# EAGLE schematic ZabavySign (EAGLE 7.2.0), part 1 of 2
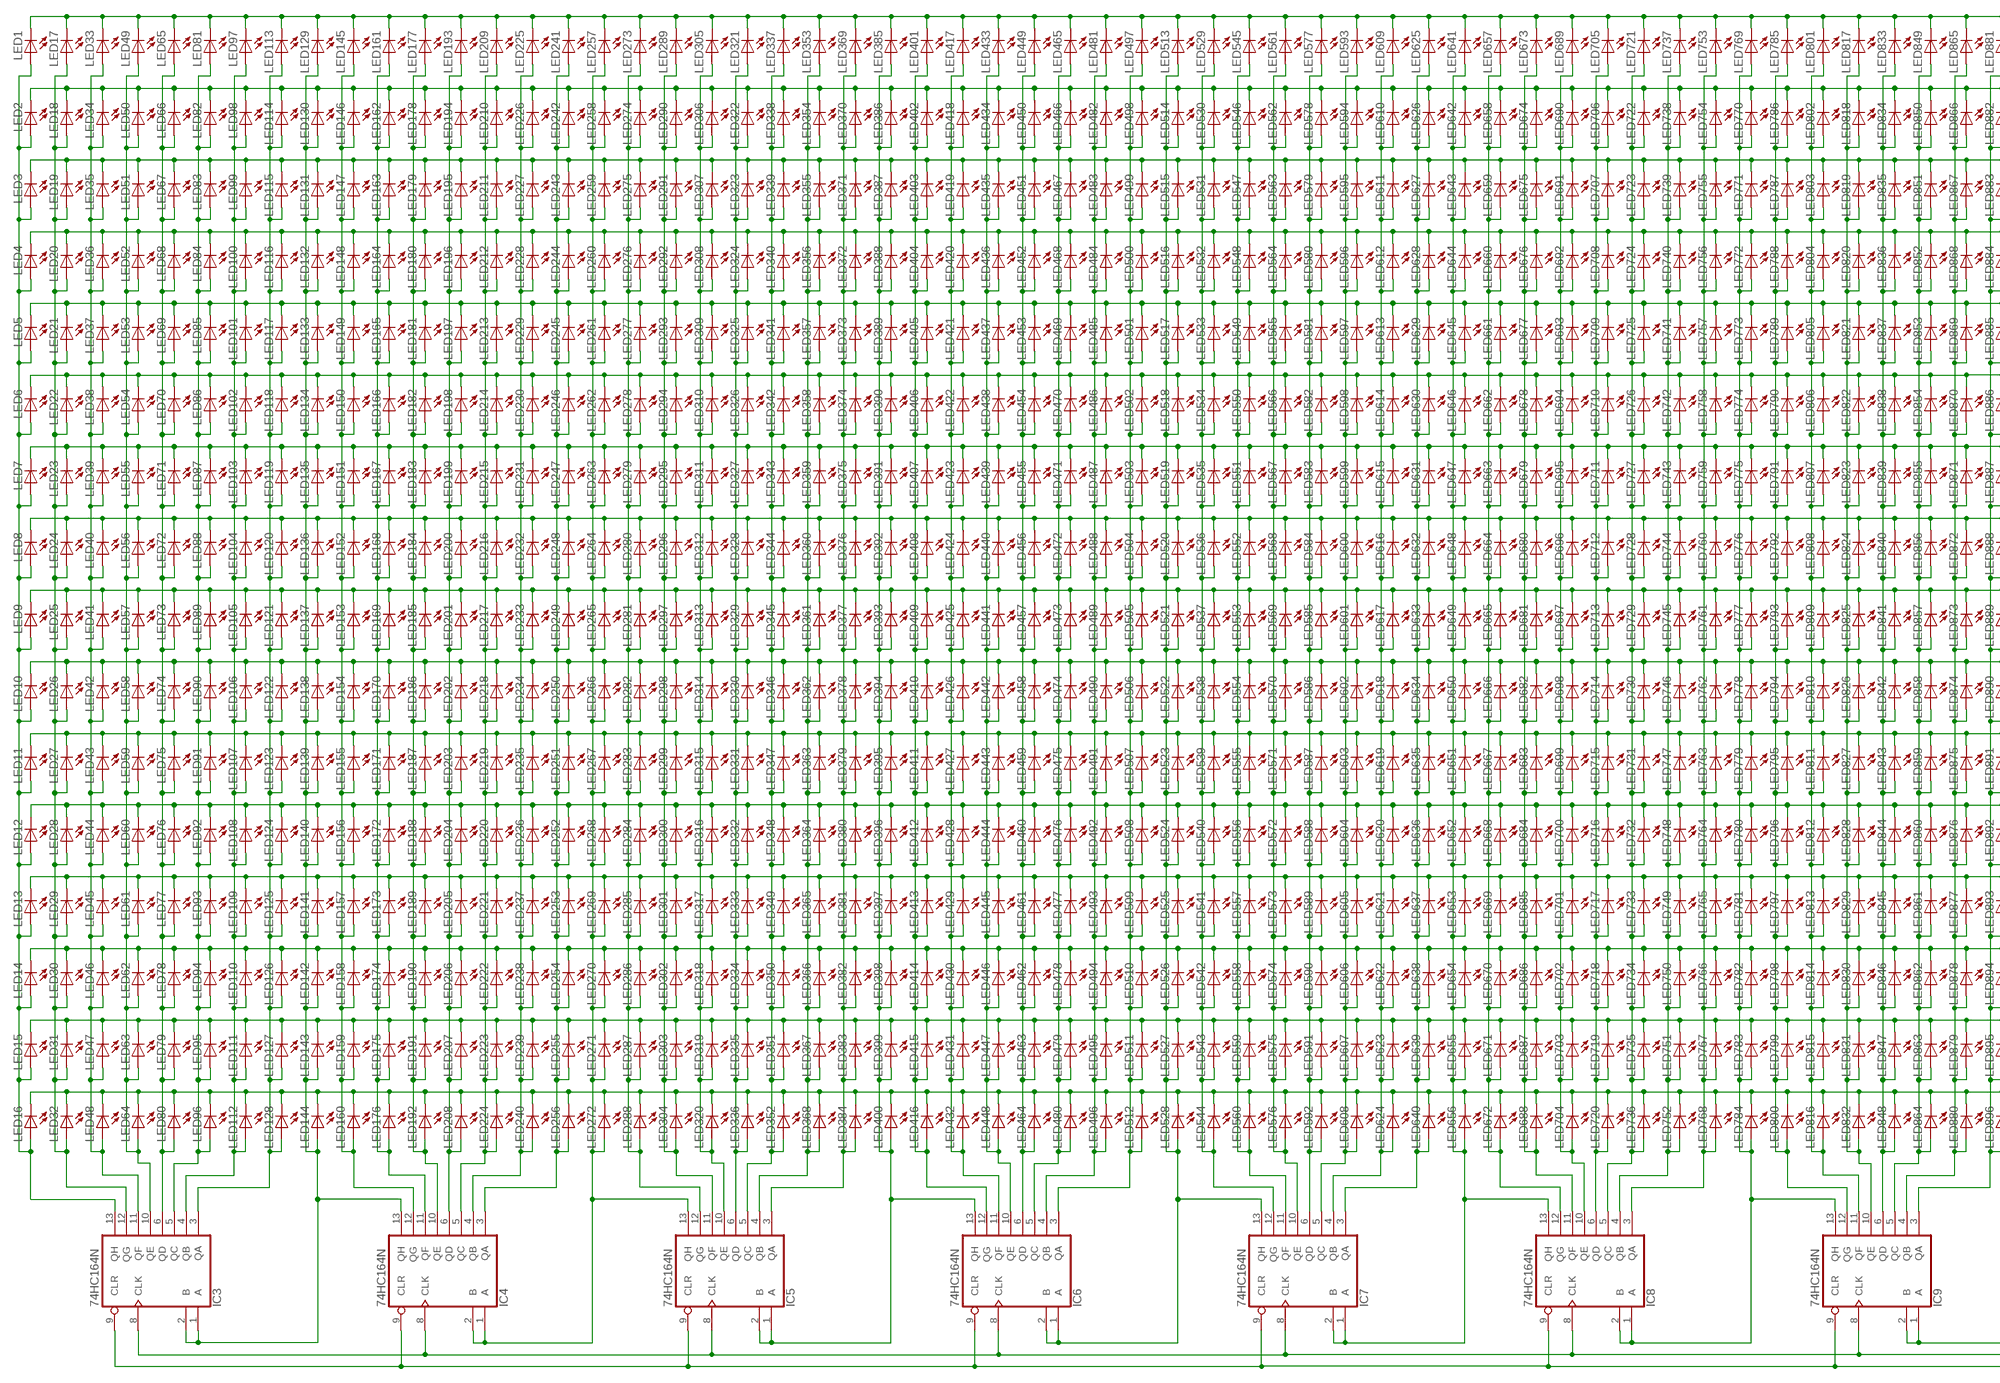
[diagram p0: schematic, sheet 1, part 1 of 2]
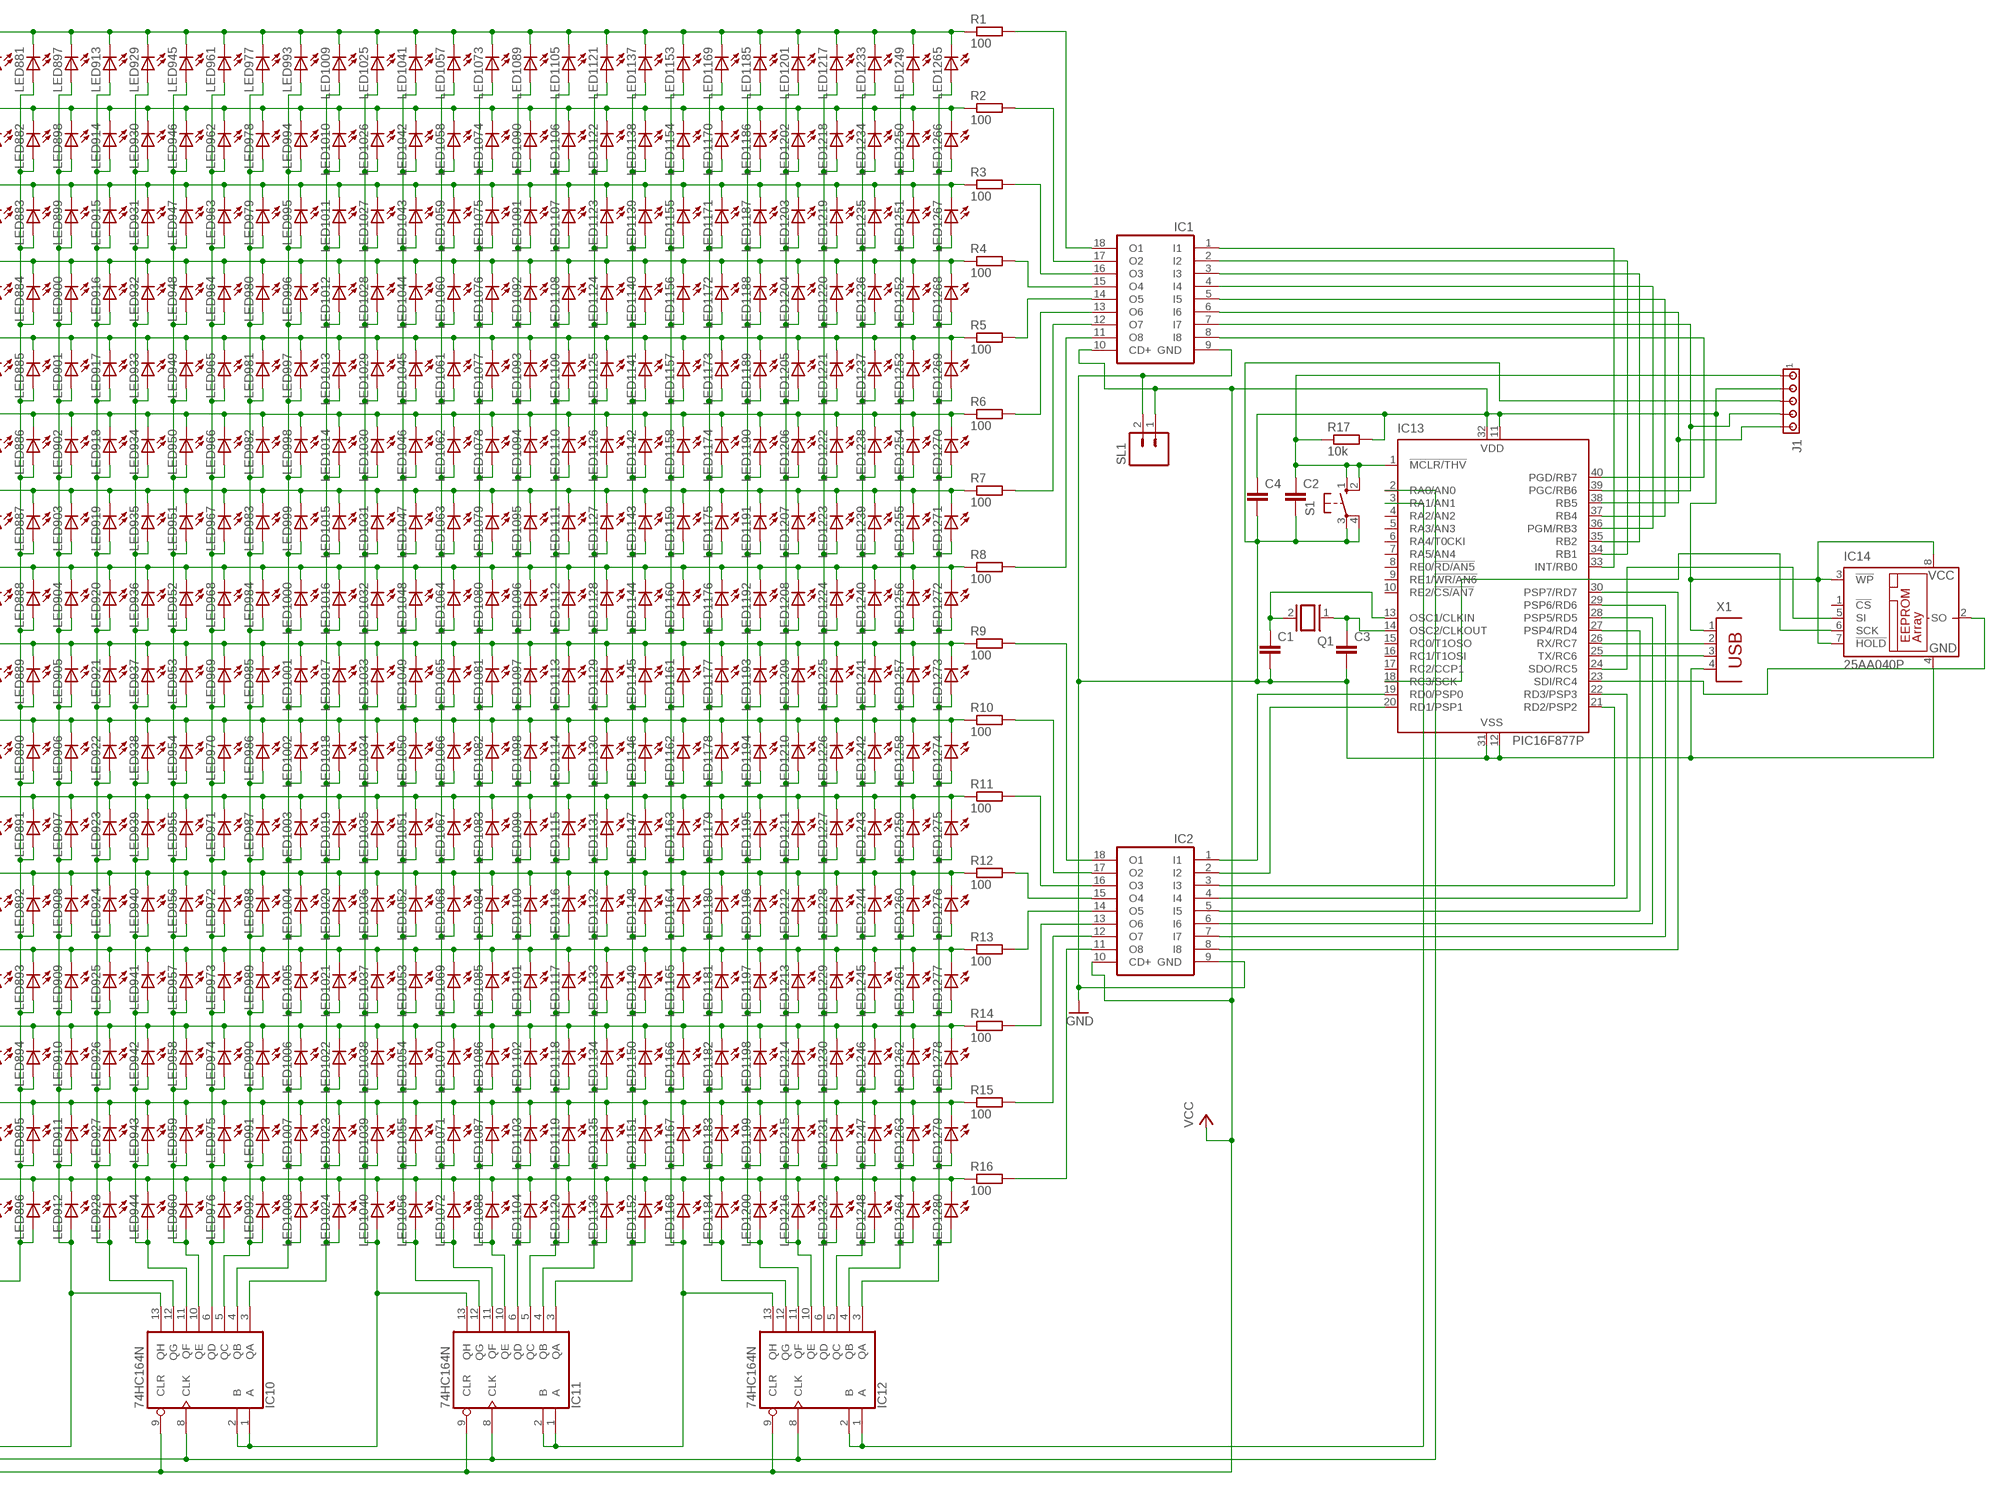
[diagram p1: schematic, sheet 1, part 2 of 2]

## Parts
C1  C-EU050-024X044  [C050-024X044]
C2  C-EU050-024X044  [C050-024X044]
C3  C-EU050-024X044  [C050-024X044]
C4  C-EU050-024X044  [C050-024X044]
IC1  ULN2803A  [DIL18]
IC2  ULN2803A  [DIL18]
IC3  74HC164N  [DIL14]
IC4  74HC164N  [DIL14]
IC5  74HC164N  [DIL14]
IC6  74HC164N  [DIL14]
IC7  74HC164N  [DIL14]
IC8  74HC164N  [DIL14]
IC9  74HC164N  [DIL14]
IC10  74HC164N  [DIL14]
IC11  74HC164N  [DIL14]
IC12  74HC164N  [DIL14]
IC13  PIC16F877P  [DIL40]
IC14  25AA040P  [DIL8]
J1  MTA05-100  [10X05MTA]
LED1  LED5MM  [LED5MM]
LED2  LED5MM  [LED5MM]
LED3  LED5MM  [LED5MM]
LED4  LED5MM  [LED5MM]
LED5  LED5MM  [LED5MM]
LED6  LED5MM  [LED5MM]
LED7  LED5MM  [LED5MM]
LED8  LED5MM  [LED5MM]
LED9  LED5MM  [LED5MM]
LED10  LED5MM  [LED5MM]
LED11  LED5MM  [LED5MM]
LED12  LED5MM  [LED5MM]
LED13  LED5MM  [LED5MM]
LED14  LED5MM  [LED5MM]
LED15  LED5MM  [LED5MM]
LED16  LED5MM  [LED5MM]
LED17  LED5MM  [LED5MM]
LED18  LED5MM  [LED5MM]
LED19  LED5MM  [LED5MM]
LED20  LED5MM  [LED5MM]
LED21  LED5MM  [LED5MM]
LED22  LED5MM  [LED5MM]
LED23  LED5MM  [LED5MM]
LED24  LED5MM  [LED5MM]
LED25  LED5MM  [LED5MM]
LED26  LED5MM  [LED5MM]
LED27  LED5MM  [LED5MM]
LED28  LED5MM  [LED5MM]
LED29  LED5MM  [LED5MM]
LED30  LED5MM  [LED5MM]
LED31  LED5MM  [LED5MM]
LED32  LED5MM  [LED5MM]
LED33  LED5MM  [LED5MM]
LED34  LED5MM  [LED5MM]
LED35  LED5MM  [LED5MM]
LED36  LED5MM  [LED5MM]
LED37  LED5MM  [LED5MM]
LED38  LED5MM  [LED5MM]
LED39  LED5MM  [LED5MM]
LED40  LED5MM  [LED5MM]
LED41  LED5MM  [LED5MM]
LED42  LED5MM  [LED5MM]
LED43  LED5MM  [LED5MM]
LED44  LED5MM  [LED5MM]
LED45  LED5MM  [LED5MM]
LED46  LED5MM  [LED5MM]
LED47  LED5MM  [LED5MM]
LED48  LED5MM  [LED5MM]
LED49  LED5MM  [LED5MM]
LED50  LED5MM  [LED5MM]
LED51  LED5MM  [LED5MM]
LED52  LED5MM  [LED5MM]
LED53  LED5MM  [LED5MM]
LED54  LED5MM  [LED5MM]
LED55  LED5MM  [LED5MM]
LED56  LED5MM  [LED5MM]
LED57  LED5MM  [LED5MM]
LED58  LED5MM  [LED5MM]
LED59  LED5MM  [LED5MM]
LED60  LED5MM  [LED5MM]
LED61  LED5MM  [LED5MM]
LED62  LED5MM  [LED5MM]
LED63  LED5MM  [LED5MM]
LED64  LED5MM  [LED5MM]
LED65  LED5MM  [LED5MM]
LED66  LED5MM  [LED5MM]
LED67  LED5MM  [LED5MM]
LED68  LED5MM  [LED5MM]
LED69  LED5MM  [LED5MM]
LED70  LED5MM  [LED5MM]
LED71  LED5MM  [LED5MM]
LED72  LED5MM  [LED5MM]
LED73  LED5MM  [LED5MM]
LED74  LED5MM  [LED5MM]
LED75  LED5MM  [LED5MM]
LED76  LED5MM  [LED5MM]
LED77  LED5MM  [LED5MM]
LED78  LED5MM  [LED5MM]
LED79  LED5MM  [LED5MM]
LED80  LED5MM  [LED5MM]
LED81  LED5MM  [LED5MM]
LED82  LED5MM  [LED5MM]
LED83  LED5MM  [LED5MM]
LED84  LED5MM  [LED5MM]
LED85  LED5MM  [LED5MM]
LED86  LED5MM  [LED5MM]
LED87  LED5MM  [LED5MM]
LED88  LED5MM  [LED5MM]
LED89  LED5MM  [LED5MM]
LED90  LED5MM  [LED5MM]
LED91  LED5MM  [LED5MM]
LED92  LED5MM  [LED5MM]
LED93  LED5MM  [LED5MM]
LED94  LED5MM  [LED5MM]
LED95  LED5MM  [LED5MM]
LED96  LED5MM  [LED5MM]
LED97  LED5MM  [LED5MM]
LED98  LED5MM  [LED5MM]
LED99  LED5MM  [LED5MM]
LED100  LED5MM  [LED5MM]
LED101  LED5MM  [LED5MM]
LED102  LED5MM  [LED5MM]
LED103  LED5MM  [LED5MM]
LED104  LED5MM  [LED5MM]
LED105  LED5MM  [LED5MM]
LED106  LED5MM  [LED5MM]
LED107  LED5MM  [LED5MM]
LED108  LED5MM  [LED5MM]
LED109  LED5MM  [LED5MM]
LED110  LED5MM  [LED5MM]
LED111  LED5MM  [LED5MM]
LED112  LED5MM  [LED5MM]
LED113  LED5MM  [LED5MM]
LED114  LED5MM  [LED5MM]
LED115  LED5MM  [LED5MM]
LED116  LED5MM  [LED5MM]
LED117  LED5MM  [LED5MM]
LED118  LED5MM  [LED5MM]
LED119  LED5MM  [LED5MM]
LED120  LED5MM  [LED5MM]
LED121  LED5MM  [LED5MM]
LED122  LED5MM  [LED5MM]
LED123  LED5MM  [LED5MM]
LED124  LED5MM  [LED5MM]
LED125  LED5MM  [LED5MM]
LED126  LED5MM  [LED5MM]
LED127  LED5MM  [LED5MM]
LED128  LED5MM  [LED5MM]
LED129  LED5MM  [LED5MM]
LED130  LED5MM  [LED5MM]
LED131  LED5MM  [LED5MM]
LED132  LED5MM  [LED5MM]
LED133  LED5MM  [LED5MM]
LED134  LED5MM  [LED5MM]
LED135  LED5MM  [LED5MM]
LED136  LED5MM  [LED5MM]
LED137  LED5MM  [LED5MM]
LED138  LED5MM  [LED5MM]
LED139  LED5MM  [LED5MM]
LED140  LED5MM  [LED5MM]
LED141  LED5MM  [LED5MM]
LED142  LED5MM  [LED5MM]
LED143  LED5MM  [LED5MM]
LED144  LED5MM  [LED5MM]
LED145  LED5MM  [LED5MM]
LED146  LED5MM  [LED5MM]
LED147  LED5MM  [LED5MM]
LED148  LED5MM  [LED5MM]
LED149  LED5MM  [LED5MM]
LED150  LED5MM  [LED5MM]
LED151  LED5MM  [LED5MM]
LED152  LED5MM  [LED5MM]
LED153  LED5MM  [LED5MM]
LED154  LED5MM  [LED5MM]
LED155  LED5MM  [LED5MM]
LED156  LED5MM  [LED5MM]
LED157  LED5MM  [LED5MM]
LED158  LED5MM  [LED5MM]
LED159  LED5MM  [LED5MM]
LED160  LED5MM  [LED5MM]
LED161  LED5MM  [LED5MM]
LED162  LED5MM  [LED5MM]
LED163  LED5MM  [LED5MM]
LED164  LED5MM  [LED5MM]
LED165  LED5MM  [LED5MM]
LED166  LED5MM  [LED5MM]
LED167  LED5MM  [LED5MM]
LED168  LED5MM  [LED5MM]
LED169  LED5MM  [LED5MM]
LED170  LED5MM  [LED5MM]
LED171  LED5MM  [LED5MM]
LED172  LED5MM  [LED5MM]
LED173  LED5MM  [LED5MM]
LED174  LED5MM  [LED5MM]
LED175  LED5MM  [LED5MM]
LED176  LED5MM  [LED5MM]
LED177  LED5MM  [LED5MM]
LED178  LED5MM  [LED5MM]
LED179  LED5MM  [LED5MM]
LED180  LED5MM  [LED5MM]
LED181  LED5MM  [LED5MM]
LED182  LED5MM  [LED5MM]
LED183  LED5MM  [LED5MM]
LED184  LED5MM  [LED5MM]
LED185  LED5MM  [LED5MM]
LED186  LED5MM  [LED5MM]
LED187  LED5MM  [LED5MM]
LED188  LED5MM  [LED5MM]
LED189  LED5MM  [LED5MM]
LED190  LED5MM  [LED5MM]
LED191  LED5MM  [LED5MM]
LED192  LED5MM  [LED5MM]
LED193  LED5MM  [LED5MM]
LED194  LED5MM  [LED5MM]
LED195  LED5MM  [LED5MM]
LED196  LED5MM  [LED5MM]
LED197  LED5MM  [LED5MM]
LED198  LED5MM  [LED5MM]
LED199  LED5MM  [LED5MM]
LED200  LED5MM  [LED5MM]
LED201  LED5MM  [LED5MM]
LED202  LED5MM  [LED5MM]
LED203  LED5MM  [LED5MM]
LED204  LED5MM  [LED5MM]
LED205  LED5MM  [LED5MM]
LED206  LED5MM  [LED5MM]
LED207  LED5MM  [LED5MM]
LED208  LED5MM  [LED5MM]
LED209  LED5MM  [LED5MM]
LED210  LED5MM  [LED5MM]
LED211  LED5MM  [LED5MM]
LED212  LED5MM  [LED5MM]
LED213  LED5MM  [LED5MM]
LED214  LED5MM  [LED5MM]
LED215  LED5MM  [LED5MM]
LED216  LED5MM  [LED5MM]
LED217  LED5MM  [LED5MM]
LED218  LED5MM  [LED5MM]
LED219  LED5MM  [LED5MM]
LED220  LED5MM  [LED5MM]
LED221  LED5MM  [LED5MM]
LED222  LED5MM  [LED5MM]
LED223  LED5MM  [LED5MM]
LED224  LED5MM  [LED5MM]
LED225  LED5MM  [LED5MM]
LED226  LED5MM  [LED5MM]
LED227  LED5MM  [LED5MM]
LED228  LED5MM  [LED5MM]
LED229  LED5MM  [LED5MM]
LED230  LED5MM  [LED5MM]
LED231  LED5MM  [LED5MM]
LED232  LED5MM  [LED5MM]
LED233  LED5MM  [LED5MM]
LED234  LED5MM  [LED5MM]
LED235  LED5MM  [LED5MM]
LED236  LED5MM  [LED5MM]
LED237  LED5MM  [LED5MM]
LED238  LED5MM  [LED5MM]
LED239  LED5MM  [LED5MM]
LED240  LED5MM  [LED5MM]
LED241  LED5MM  [LED5MM]
LED242  LED5MM  [LED5MM]
LED243  LED5MM  [LED5MM]
LED244  LED5MM  [LED5MM]
LED245  LED5MM  [LED5MM]
LED246  LED5MM  [LED5MM]
LED247  LED5MM  [LED5MM]
LED248  LED5MM  [LED5MM]
LED249  LED5MM  [LED5MM]
LED250  LED5MM  [LED5MM]
LED251  LED5MM  [LED5MM]
LED252  LED5MM  [LED5MM]
LED253  LED5MM  [LED5MM]
LED254  LED5MM  [LED5MM]
LED255  LED5MM  [LED5MM]
LED256  LED5MM  [LED5MM]
LED257  LED5MM  [LED5MM]
LED258  LED5MM  [LED5MM]
LED259  LED5MM  [LED5MM]
LED260  LED5MM  [LED5MM]
LED261  LED5MM  [LED5MM]
LED262  LED5MM  [LED5MM]
LED263  LED5MM  [LED5MM]
LED264  LED5MM  [LED5MM]
LED265  LED5MM  [LED5MM]
LED266  LED5MM  [LED5MM]
LED267  LED5MM  [LED5MM]
LED268  LED5MM  [LED5MM]
LED269  LED5MM  [LED5MM]
LED270  LED5MM  [LED5MM]
LED271  LED5MM  [LED5MM]
LED272  LED5MM  [LED5MM]
LED273  LED5MM  [LED5MM]
LED274  LED5MM  [LED5MM]
LED275  LED5MM  [LED5MM]
LED276  LED5MM  [LED5MM]
LED277  LED5MM  [LED5MM]
LED278  LED5MM  [LED5MM]
LED279  LED5MM  [LED5MM]
LED280  LED5MM  [LED5MM]
LED281  LED5MM  [LED5MM]
LED282  LED5MM  [LED5MM]
LED283  LED5MM  [LED5MM]
LED284  LED5MM  [LED5MM]
LED285  LED5MM  [LED5MM]
LED286  LED5MM  [LED5MM]
LED287  LED5MM  [LED5MM]
LED288  LED5MM  [LED5MM]
LED289  LED5MM  [LED5MM]
LED290  LED5MM  [LED5MM]
LED291  LED5MM  [LED5MM]
LED292  LED5MM  [LED5MM]
LED293  LED5MM  [LED5MM]
LED294  LED5MM  [LED5MM]
LED295  LED5MM  [LED5MM]
LED296  LED5MM  [LED5MM]
LED297  LED5MM  [LED5MM]
LED298  LED5MM  [LED5MM]
LED299  LED5MM  [LED5MM]
LED300  LED5MM  [LED5MM]
LED301  LED5MM  [LED5MM]
LED302  LED5MM  [LED5MM]
LED303  LED5MM  [LED5MM]
LED304  LED5MM  [LED5MM]
LED305  LED5MM  [LED5MM]
LED306  LED5MM  [LED5MM]
LED307  LED5MM  [LED5MM]
LED308  LED5MM  [LED5MM]
LED309  LED5MM  [LED5MM]
LED310  LED5MM  [LED5MM]
LED311  LED5MM  [LED5MM]
LED312  LED5MM  [LED5MM]
LED313  LED5MM  [LED5MM]
LED314  LED5MM  [LED5MM]
LED315  LED5MM  [LED5MM]
LED316  LED5MM  [LED5MM]
LED317  LED5MM  [LED5MM]
LED318  LED5MM  [LED5MM]
LED319  LED5MM  [LED5MM]
LED320  LED5MM  [LED5MM]
LED321  LED5MM  [LED5MM]
LED322  LED5MM  [LED5MM]
LED323  LED5MM  [LED5MM]
LED324  LED5MM  [LED5MM]
LED325  LED5MM  [LED5MM]
LED326  LED5MM  [LED5MM]
LED327  LED5MM  [LED5MM]
LED328  LED5MM  [LED5MM]
LED329  LED5MM  [LED5MM]
LED330  LED5MM  [LED5MM]
LED331  LED5MM  [LED5MM]
LED332  LED5MM  [LED5MM]
LED333  LED5MM  [LED5MM]
LED334  LED5MM  [LED5MM]
LED335  LED5MM  [LED5MM]
LED336  LED5MM  [LED5MM]
LED337  LED5MM  [LED5MM]
LED338  LED5MM  [LED5MM]
LED339  LED5MM  [LED5MM]
LED340  LED5MM  [LED5MM]
LED341  LED5MM  [LED5MM]
LED342  LED5MM  [LED5MM]
LED343  LED5MM  [LED5MM]
LED344  LED5MM  [LED5MM]
LED345  LED5MM  [LED5MM]
LED346  LED5MM  [LED5MM]
LED347  LED5MM  [LED5MM]
LED348  LED5MM  [LED5MM]
LED349  LED5MM  [LED5MM]
LED350  LED5MM  [LED5MM]
LED351  LED5MM  [LED5MM]
LED352  LED5MM  [LED5MM]
LED353  LED5MM  [LED5MM]
LED354  LED5MM  [LED5MM]
LED355  LED5MM  [LED5MM]
LED356  LED5MM  [LED5MM]
LED357  LED5MM  [LED5MM]
LED358  LED5MM  [LED5MM]
LED359  LED5MM  [LED5MM]
LED360  LED5MM  [LED5MM]
LED361  LED5MM  [LED5MM]
LED362  LED5MM  [LED5MM]
LED363  LED5MM  [LED5MM]
LED364  LED5MM  [LED5MM]
LED365  LED5MM  [LED5MM]
LED366  LED5MM  [LED5MM]
LED367  LED5MM  [LED5MM]
LED368  LED5MM  [LED5MM]
LED369  LED5MM  [LED5MM]
LED370  LED5MM  [LED5MM]
LED371  LED5MM  [LED5MM]
LED372  LED5MM  [LED5MM]
LED373  LED5MM  [LED5MM]
LED374  LED5MM  [LED5MM]
LED375  LED5MM  [LED5MM]
LED376  LED5MM  [LED5MM]
LED377  LED5MM  [LED5MM]
LED378  LED5MM  [LED5MM]
LED379  LED5MM  [LED5MM]
LED380  LED5MM  [LED5MM]
LED381  LED5MM  [LED5MM]
LED382  LED5MM  [LED5MM]
LED383  LED5MM  [LED5MM]
LED384  LED5MM  [LED5MM]
LED385  LED5MM  [LED5MM]
LED386  LED5MM  [LED5MM]
LED387  LED5MM  [LED5MM]
LED388  LED5MM  [LED5MM]
LED389  LED5MM  [LED5MM]
LED390  LED5MM  [LED5MM]
LED391  LED5MM  [LED5MM]
LED392  LED5MM  [LED5MM]
LED393  LED5MM  [LED5MM]
LED394  LED5MM  [LED5MM]
LED395  LED5MM  [LED5MM]
LED396  LED5MM  [LED5MM]
LED397  LED5MM  [LED5MM]
LED398  LED5MM  [LED5MM]
LED399  LED5MM  [LED5MM]
LED400  LED5MM  [LED5MM]
LED401  LED5MM  [LED5MM]
LED402  LED5MM  [LED5MM]
LED403  LED5MM  [LED5MM]
LED404  LED5MM  [LED5MM]
LED405  LED5MM  [LED5MM]
LED406  LED5MM  [LED5MM]
LED407  LED5MM  [LED5MM]
LED408  LED5MM  [LED5MM]
LED409  LED5MM  [LED5MM]
LED410  LED5MM  [LED5MM]
LED411  LED5MM  [LED5MM]
LED412  LED5MM  [LED5MM]
LED413  LED5MM  [LED5MM]
LED414  LED5MM  [LED5MM]
LED415  LED5MM  [LED5MM]
LED416  LED5MM  [LED5MM]
LED417  LED5MM  [LED5MM]
LED418  LED5MM  [LED5MM]
LED419  LED5MM  [LED5MM]
LED420  LED5MM  [LED5MM]
LED421  LED5MM  [LED5MM]
LED422  LED5MM  [LED5MM]
LED423  LED5MM  [LED5MM]
LED424  LED5MM  [LED5MM]
LED425  LED5MM  [LED5MM]
LED426  LED5MM  [LED5MM]
LED427  LED5MM  [LED5MM]
LED428  LED5MM  [LED5MM]
LED429  LED5MM  [LED5MM]
LED430  LED5MM  [LED5MM]
LED431  LED5MM  [LED5MM]
LED432  LED5MM  [LED5MM]
LED433  LED5MM  [LED5MM]
LED434  LED5MM  [LED5MM]
LED435  LED5MM  [LED5MM]
LED436  LED5MM  [LED5MM]
LED437  LED5MM  [LED5MM]
LED438  LED5MM  [LED5MM]
LED439  LED5MM  [LED5MM]
LED440  LED5MM  [LED5MM]
LED441  LED5MM  [LED5MM]
LED442  LED5MM  [LED5MM]
LED443  LED5MM  [LED5MM]
LED444  LED5MM  [LED5MM]
LED445  LED5MM  [LED5MM]
LED446  LED5MM  [LED5MM]
LED447  LED5MM  [LED5MM]
LED448  LED5MM  [LED5MM]
LED449  LED5MM  [LED5MM]
LED450  LED5MM  [LED5MM]
LED451  LED5MM  [LED5MM]
LED452  LED5MM  [LED5MM]
LED453  LED5MM  [LED5MM]
LED454  LED5MM  [LED5MM]
LED455  LED5MM  [LED5MM]
LED456  LED5MM  [LED5MM]
LED457  LED5MM  [LED5MM]
LED458  LED5MM  [LED5MM]
LED459  LED5MM  [LED5MM]
LED460  LED5MM  [LED5MM]
LED461  LED5MM  [LED5MM]
LED462  LED5MM  [LED5MM]
LED463  LED5MM  [LED5MM]
LED464  LED5MM  [LED5MM]
LED465  LED5MM  [LED5MM]
LED466  LED5MM  [LED5MM]
LED467  LED5MM  [LED5MM]
LED468  LED5MM  [LED5MM]
LED469  LED5MM  [LED5MM]
LED470  LED5MM  [LED5MM]
LED471  LED5MM  [LED5MM]
LED472  LED5MM  [LED5MM]
LED473  LED5MM  [LED5MM]
LED474  LED5MM  [LED5MM]
LED475  LED5MM  [LED5MM]
LED476  LED5MM  [LED5MM]
LED477  LED5MM  [LED5MM]
LED478  LED5MM  [LED5MM]
LED479  LED5MM  [LED5MM]
LED480  LED5MM  [LED5MM]
LED481  LED5MM  [LED5MM]
LED482  LED5MM  [LED5MM]
LED483  LED5MM  [LED5MM]
LED484  LED5MM  [LED5MM]
LED485  LED5MM  [LED5MM]
LED486  LED5MM  [LED5MM]
LED487  LED5MM  [LED5MM]
LED488  LED5MM  [LED5MM]
LED489  LED5MM  [LED5MM]
LED490  LED5MM  [LED5MM]
LED491  LED5MM  [LED5MM]
LED492  LED5MM  [LED5MM]
LED493  LED5MM  [LED5MM]
LED494  LED5MM  [LED5MM]
LED495  LED5MM  [LED5MM]
LED496  LED5MM  [LED5MM]
LED497  LED5MM  [LED5MM]
LED498  LED5MM  [LED5MM]
LED499  LED5MM  [LED5MM]
LED500  LED5MM  [LED5MM]
LED501  LED5MM  [LED5MM]
LED502  LED5MM  [LED5MM]
LED503  LED5MM  [LED5MM]
LED504  LED5MM  [LED5MM]
LED505  LED5MM  [LED5MM]
LED506  LED5MM  [LED5MM]
LED507  LED5MM  [LED5MM]
LED508  LED5MM  [LED5MM]
LED509  LED5MM  [LED5MM]
LED510  LED5MM  [LED5MM]
LED511  LED5MM  [LED5MM]
LED512  LED5MM  [LED5MM]
LED513  LED5MM  [LED5MM]
LED514  LED5MM  [LED5MM]
LED515  LED5MM  [LED5MM]
LED516  LED5MM  [LED5MM]
LED517  LED5MM  [LED5MM]
LED518  LED5MM  [LED5MM]
LED519  LED5MM  [LED5MM]
LED520  LED5MM  [LED5MM]
LED521  LED5MM  [LED5MM]
LED522  LED5MM  [LED5MM]
LED523  LED5MM  [LED5MM]
LED524  LED5MM  [LED5MM]
LED525  LED5MM  [LED5MM]
LED526  LED5MM  [LED5MM]
LED527  LED5MM  [LED5MM]
LED528  LED5MM  [LED5MM]
LED529  LED5MM  [LED5MM]
LED530  LED5MM  [LED5MM]
LED531  LED5MM  [LED5MM]
LED532  LED5MM  [LED5MM]
LED533  LED5MM  [LED5MM]
LED534  LED5MM  [LED5MM]
LED535  LED5MM  [LED5MM]
LED536  LED5MM  [LED5MM]
LED537  LED5MM  [LED5MM]
LED538  LED5MM  [LED5MM]
LED539  LED5MM  [LED5MM]
LED540  LED5MM  [LED5MM]
LED541  LED5MM  [LED5MM]
LED542  LED5MM  [LED5MM]
LED543  LED5MM  [LED5MM]
LED544  LED5MM  [LED5MM]
LED545  LED5MM  [LED5MM]
LED546  LED5MM  [LED5MM]
LED547  LED5MM  [LED5MM]
LED548  LED5MM  [LED5MM]
LED549  LED5MM  [LED5MM]
LED550  LED5MM  [LED5MM]
LED551  LED5MM  [LED5MM]
LED552  LED5MM  [LED5MM]
LED553  LED5MM  [LED5MM]
LED554  LED5MM  [LED5MM]
LED555  LED5MM  [LED5MM]
LED556  LED5MM  [LED5MM]
LED557  LED5MM  [LED5MM]
LED558  LED5MM  [LED5MM]
LED559  LED5MM  [LED5MM]
LED560  LED5MM  [LED5MM]
LED561  LED5MM  [LED5MM]
LED562  LED5MM  [LED5MM]
LED563  LED5MM  [LED5MM]
LED564  LED5MM  [LED5MM]
LED565  LED5MM  [LED5MM]
LED566  LED5MM  [LED5MM]
LED567  LED5MM  [LED5MM]
LED568  LED5MM  [LED5MM]
LED569  LED5MM  [LED5MM]
LED570  LED5MM  [LED5MM]
LED571  LED5MM  [LED5MM]
LED572  LED5MM  [LED5MM]
LED573  LED5MM  [LED5MM]
LED574  LED5MM  [LED5MM]
LED575  LED5MM  [LED5MM]
LED576  LED5MM  [LED5MM]
LED577  LED5MM  [LED5MM]
LED578  LED5MM  [LED5MM]
LED579  LED5MM  [LED5MM]
LED580  LED5MM  [LED5MM]
LED581  LED5MM  [LED5MM]
LED582  LED5MM  [LED5MM]
LED583  LED5MM  [LED5MM]
LED584  LED5MM  [LED5MM]
LED585  LED5MM  [LED5MM]
LED586  LED5MM  [LED5MM]
LED587  LED5MM  [LED5MM]
LED588  LED5MM  [LED5MM]
LED589  LED5MM  [LED5MM]
LED590  LED5MM  [LED5MM]
LED591  LED5MM  [LED5MM]
LED592  LED5MM  [LED5MM]
LED593  LED5MM  [LED5MM]
LED594  LED5MM  [LED5MM]
LED595  LED5MM  [LED5MM]
LED596  LED5MM  [LED5MM]
LED597  LED5MM  [LED5MM]
LED598  LED5MM  [LED5MM]
LED599  LED5MM  [LED5MM]
LED600  LED5MM  [LED5MM]
LED601  LED5MM  [LED5MM]
LED602  LED5MM  [LED5MM]
LED603  LED5MM  [LED5MM]
LED604  LED5MM  [LED5MM]
LED605  LED5MM  [LED5MM]
LED606  LED5MM  [LED5MM]
LED607  LED5MM  [LED5MM]
LED608  LED5MM  [LED5MM]
LED609  LED5MM  [LED5MM]
LED610  LED5MM  [LED5MM]
LED611  LED5MM  [LED5MM]
LED612  LED5MM  [LED5MM]
LED613  LED5MM  [LED5MM]
LED614  LED5MM  [LED5MM]
LED615  LED5MM  [LED5MM]
LED616  LED5MM  [LED5MM]
LED617  LED5MM  [LED5MM]
LED618  LED5MM  [LED5MM]
LED619  LED5MM  [LED5MM]
LED620  LED5MM  [LED5MM]
LED621  LED5MM  [LED5MM]
LED622  LED5MM  [LED5MM]
LED623  LED5MM  [LED5MM]
LED624  LED5MM  [LED5MM]
LED625  LED5MM  [LED5MM]
LED626  LED5MM  [LED5MM]
LED627  LED5MM  [LED5MM]
LED628  LED5MM  [LED5MM]
LED629  LED5MM  [LED5MM]
LED630  LED5MM  [LED5MM]
LED631  LED5MM  [LED5MM]
LED632  LED5MM  [LED5MM]
LED633  LED5MM  [LED5MM]
LED634  LED5MM  [LED5MM]
LED635  LED5MM  [LED5MM]
LED636  LED5MM  [LED5MM]
LED637  LED5MM  [LED5MM]
LED638  LED5MM  [LED5MM]
LED639  LED5MM  [LED5MM]
LED640  LED5MM  [LED5MM]
LED641  LED5MM  [LED5MM]
LED642  LED5MM  [LED5MM]
LED643  LED5MM  [LED5MM]
LED644  LED5MM  [LED5MM]
LED645  LED5MM  [LED5MM]
LED646  LED5MM  [LED5MM]
LED647  LED5MM  [LED5MM]
LED648  LED5MM  [LED5MM]
LED649  LED5MM  [LED5MM]
LED650  LED5MM  [LED5MM]
LED651  LED5MM  [LED5MM]
LED652  LED5MM  [LED5MM]
LED653  LED5MM  [LED5MM]
LED654  LED5MM  [LED5MM]
LED655  LED5MM  [LED5MM]
LED656  LED5MM  [LED5MM]
LED657  LED5MM  [LED5MM]
LED658  LED5MM  [LED5MM]
LED659  LED5MM  [LED5MM]
LED660  LED5MM  [LED5MM]
LED661  LED5MM  [LED5MM]
LED662  LED5MM  [LED5MM]
LED663  LED5MM  [LED5MM]
LED664  LED5MM  [LED5MM]
LED665  LED5MM  [LED5MM]
LED666  LED5MM  [LED5MM]
LED667  LED5MM  [LED5MM]
LED668  LED5MM  [LED5MM]
LED669  LED5MM  [LED5MM]
LED670  LED5MM  [LED5MM]
LED671  LED5MM  [LED5MM]
LED672  LED5MM  [LED5MM]
LED673  LED5MM  [LED5MM]
LED674  LED5MM  [LED5MM]
LED675  LED5MM  [LED5MM]
LED676  LED5MM  [LED5MM]
LED677  LED5MM  [LED5MM]
LED678  LED5MM  [LED5MM]
LED679  LED5MM  [LED5MM]
LED680  LED5MM  [LED5MM]
LED681  LED5MM  [LED5MM]
LED682  LED5MM  [LED5MM]
LED683  LED5MM  [LED5MM]
LED684  LED5MM  [LED5MM]
LED685  LED5MM  [LED5MM]
LED686  LED5MM  [LED5MM]
LED687  LED5MM  [LED5MM]
LED688  LED5MM  [LED5MM]
LED689  LED5MM  [LED5MM]
LED690  LED5MM  [LED5MM]
LED691  LED5MM  [LED5MM]
LED692  LED5MM  [LED5MM]
LED693  LED5MM  [LED5MM]
LED694  LED5MM  [LED5MM]
LED695  LED5MM  [LED5MM]
LED696  LED5MM  [LED5MM]
LED697  LED5MM  [LED5MM]
LED698  LED5MM  [LED5MM]
LED699  LED5MM  [LED5MM]
LED700  LED5MM  [LED5MM]
LED701  LED5MM  [LED5MM]
LED702  LED5MM  [LED5MM]
LED703  LED5MM  [LED5MM]
LED704  LED5MM  [LED5MM]
LED705  LED5MM  [LED5MM]
LED706  LED5MM  [LED5MM]
LED707  LED5MM  [LED5MM]
LED708  LED5MM  [LED5MM]
LED709  LED5MM  [LED5MM]
LED710  LED5MM  [LED5MM]
LED711  LED5MM  [LED5MM]
LED712  LED5MM  [LED5MM]
LED713  LED5MM  [LED5MM]
LED714  LED5MM  [LED5MM]
LED715  LED5MM  [LED5MM]
LED716  LED5MM  [LED5MM]
LED717  LED5MM  [LED5MM]
LED718  LED5MM  [LED5MM]
LED719  LED5MM  [LED5MM]
LED720  LED5MM  [LED5MM]
LED721  LED5MM  [LED5MM]
LED722  LED5MM  [LED5MM]
LED723  LED5MM  [LED5MM]
LED724  LED5MM  [LED5MM]
LED725  LED5MM  [LED5MM]
LED726  LED5MM  [LED5MM]
LED727  LED5MM  [LED5MM]
LED728  LED5MM  [LED5MM]
LED729  LED5MM  [LED5MM]
LED730  LED5MM  [LED5MM]
LED731  LED5MM  [LED5MM]
LED732  LED5MM  [LED5MM]
LED733  LED5MM  [LED5MM]
LED734  LED5MM  [LED5MM]
LED735  LED5MM  [LED5MM]
LED736  LED5MM  [LED5MM]
LED737  LED5MM  [LED5MM]
LED738  LED5MM  [LED5MM]
LED739  LED5MM  [LED5MM]
LED740  LED5MM  [LED5MM]
LED741  LED5MM  [LED5MM]
LED742  LED5MM  [LED5MM]
LED743  LED5MM  [LED5MM]
LED744  LED5MM  [LED5MM]
LED745  LED5MM  [LED5MM]
LED746  LED5MM  [LED5MM]
LED747  LED5MM  [LED5MM]
LED748  LED5MM  [LED5MM]
LED749  LED5MM  [LED5MM]
LED750  LED5MM  [LED5MM]
LED751  LED5MM  [LED5MM]
LED752  LED5MM  [LED5MM]
LED753  LED5MM  [LED5MM]
LED754  LED5MM  [LED5MM]
LED755  LED5MM  [LED5MM]
LED756  LED5MM  [LED5MM]
LED757  LED5MM  [LED5MM]
LED758  LED5MM  [LED5MM]
LED759  LED5MM  [LED5MM]
LED760  LED5MM  [LED5MM]
LED761  LED5MM  [LED5MM]
LED762  LED5MM  [LED5MM]
LED763  LED5MM  [LED5MM]
LED764  LED5MM  [LED5MM]
LED765  LED5MM  [LED5MM]
LED766  LED5MM  [LED5MM]
LED767  LED5MM  [LED5MM]
LED768  LED5MM  [LED5MM]
LED769  LED5MM  [LED5MM]
LED770  LED5MM  [LED5MM]
LED771  LED5MM  [LED5MM]
LED772  LED5MM  [LED5MM]
LED773  LED5MM  [LED5MM]
LED774  LED5MM  [LED5MM]
LED775  LED5MM  [LED5MM]
LED776  LED5MM  [LED5MM]
LED777  LED5MM  [LED5MM]
LED778  LED5MM  [LED5MM]
LED779  LED5MM  [LED5MM]
LED780  LED5MM  [LED5MM]
LED781  LED5MM  [LED5MM]
LED782  LED5MM  [LED5MM]
LED783  LED5MM  [LED5MM]
LED784  LED5MM  [LED5MM]
LED785  LED5MM  [LED5MM]
LED786  LED5MM  [LED5MM]
LED787  LED5MM  [LED5MM]
LED788  LED5MM  [LED5MM]
LED789  LED5MM  [LED5MM]
LED790  LED5MM  [LED5MM]
LED791  LED5MM  [LED5MM]
LED792  LED5MM  [LED5MM]
LED793  LED5MM  [LED5MM]
LED794  LED5MM  [LED5MM]
LED795  LED5MM  [LED5MM]
LED796  LED5MM  [LED5MM]
LED797  LED5MM  [LED5MM]
LED798  LED5MM  [LED5MM]
LED799  LED5MM  [LED5MM]
LED800  LED5MM  [LED5MM]
LED801  LED5MM  [LED5MM]
LED802  LED5MM  [LED5MM]
LED803  LED5MM  [LED5MM]
LED804  LED5MM  [LED5MM]
LED805  LED5MM  [LED5MM]
LED806  LED5MM  [LED5MM]
LED807  LED5MM  [LED5MM]
LED808  LED5MM  [LED5MM]
LED809  LED5MM  [LED5MM]
LED810  LED5MM  [LED5MM]
LED811  LED5MM  [LED5MM]
LED812  LED5MM  [LED5MM]
LED813  LED5MM  [LED5MM]
LED814  LED5MM  [LED5MM]
LED815  LED5MM  [LED5MM]
LED816  LED5MM  [LED5MM]
LED817  LED5MM  [LED5MM]
LED818  LED5MM  [LED5MM]
LED819  LED5MM  [LED5MM]
LED820  LED5MM  [LED5MM]
LED821  LED5MM  [LED5MM]
LED822  LED5MM  [LED5MM]
LED823  LED5MM  [LED5MM]
LED824  LED5MM  [LED5MM]
LED825  LED5MM  [LED5MM]
LED826  LED5MM  [LED5MM]
LED827  LED5MM  [LED5MM]
LED828  LED5MM  [LED5MM]
LED829  LED5MM  [LED5MM]
LED830  LED5MM  [LED5MM]
LED831  LED5MM  [LED5MM]
LED832  LED5MM  [LED5MM]
LED833  LED5MM  [LED5MM]
LED834  LED5MM  [LED5MM]
LED835  LED5MM  [LED5MM]
LED836  LED5MM  [LED5MM]
LED837  LED5MM  [LED5MM]
LED838  LED5MM  [LED5MM]
LED839  LED5MM  [LED5MM]
LED840  LED5MM  [LED5MM]
LED841  LED5MM  [LED5MM]
LED842  LED5MM  [LED5MM]
LED843  LED5MM  [LED5MM]
LED844  LED5MM  [LED5MM]
LED845  LED5MM  [LED5MM]
LED846  LED5MM  [LED5MM]
LED847  LED5MM  [LED5MM]
LED848  LED5MM  [LED5MM]
LED849  LED5MM  [LED5MM]
LED850  LED5MM  [LED5MM]
LED851  LED5MM  [LED5MM]
LED852  LED5MM  [LED5MM]
LED853  LED5MM  [LED5MM]
LED854  LED5MM  [LED5MM]
LED855  LED5MM  [LED5MM]
LED856  LED5MM  [LED5MM]
LED857  LED5MM  [LED5MM]
LED858  LED5MM  [LED5MM]
LED859  LED5MM  [LED5MM]
LED860  LED5MM  [LED5MM]
LED861  LED5MM  [LED5MM]
LED862  LED5MM  [LED5MM]
LED863  LED5MM  [LED5MM]
LED864  LED5MM  [LED5MM]
LED865  LED5MM  [LED5MM]
LED866  LED5MM  [LED5MM]
LED867  LED5MM  [LED5MM]
LED868  LED5MM  [LED5MM]
LED869  LED5MM  [LED5MM]
LED870  LED5MM  [LED5MM]
LED871  LED5MM  [LED5MM]
LED872  LED5MM  [LED5MM]
LED873  LED5MM  [LED5MM]
LED874  LED5MM  [LED5MM]
LED875  LED5MM  [LED5MM]
LED876  LED5MM  [LED5MM]
LED877  LED5MM  [LED5MM]
LED878  LED5MM  [LED5MM]
LED879  LED5MM  [LED5MM]
LED880  LED5MM  [LED5MM]
LED881  LED5MM  [LED5MM]
LED882  LED5MM  [LED5MM]
LED883  LED5MM  [LED5MM]
LED884  LED5MM  [LED5MM]
LED885  LED5MM  [LED5MM]
LED886  LED5MM  [LED5MM]
LED887  LED5MM  [LED5MM]
LED888  LED5MM  [LED5MM]
LED889  LED5MM  [LED5MM]
LED890  LED5MM  [LED5MM]
LED891  LED5MM  [LED5MM]
LED892  LED5MM  [LED5MM]
LED893  LED5MM  [LED5MM]
LED894  LED5MM  [LED5MM]
LED895  LED5MM  [LED5MM]
LED896  LED5MM  [LED5MM]
LED897  LED5MM  [LED5MM]
LED898  LED5MM  [LED5MM]
LED899  LED5MM  [LED5MM]
LED900  LED5MM  [LED5MM]
LED901  LED5MM  [LED5MM]
LED902  LED5MM  [LED5MM]
LED903  LED5MM  [LED5MM]
LED904  LED5MM  [LED5MM]
LED905  LED5MM  [LED5MM]
LED906  LED5MM  [LED5MM]
LED907  LED5MM  [LED5MM]
LED908  LED5MM  [LED5MM]
LED909  LED5MM  [LED5MM]
LED910  LED5MM  [LED5MM]
LED911  LED5MM  [LED5MM]
LED912  LED5MM  [LED5MM]
LED913  LED5MM  [LED5MM]
LED914  LED5MM  [LED5MM]
LED915  LED5MM  [LED5MM]
LED916  LED5MM  [LED5MM]
LED917  LED5MM  [LED5MM]
LED918  LED5MM  [LED5MM]
LED919  LED5MM  [LED5MM]
LED920  LED5MM  [LED5MM]
LED921  LED5MM  [LED5MM]
LED922  LED5MM  [LED5MM]
LED923  LED5MM  [LED5MM]
LED924  LED5MM  [LED5MM]
LED925  LED5MM  [LED5MM]
LED926  LED5MM  [LED5MM]
LED927  LED5MM  [LED5MM]
LED928  LED5MM  [LED5MM]
LED929  LED5MM  [LED5MM]
LED930  LED5MM  [LED5MM]
LED931  LED5MM  [LED5MM]
LED932  LED5MM  [LED5MM]
LED933  LED5MM  [LED5MM]
LED934  LED5MM  [LED5MM]
LED935  LED5MM  [LED5MM]
LED936  LED5MM  [LED5MM]
LED937  LED5MM  [LED5MM]
LED938  LED5MM  [LED5MM]
LED939  LED5MM  [LED5MM]
LED940  LED5MM  [LED5MM]
LED941  LED5MM  [LED5MM]
LED942  LED5MM  [LED5MM]
LED943  LED5MM  [LED5MM]
LED944  LED5MM  [LED5MM]
LED945  LED5MM  [LED5MM]
LED946  LED5MM  [LED5MM]
LED947  LED5MM  [LED5MM]
LED948  LED5MM  [LED5MM]
LED949  LED5MM  [LED5MM]
LED950  LED5MM  [LED5MM]
LED951  LED5MM  [LED5MM]
LED952  LED5MM  [LED5MM]
LED953  LED5MM  [LED5MM]
LED954  LED5MM  [LED5MM]
LED955  LED5MM  [LED5MM]
LED956  LED5MM  [LED5MM]
LED957  LED5MM  [LED5MM]
LED958  LED5MM  [LED5MM]
LED959  LED5MM  [LED5MM]
LED960  LED5MM  [LED5MM]
LED961  LED5MM  [LED5MM]
LED962  LED5MM  [LED5MM]
LED963  LED5MM  [LED5MM]
LED964  LED5MM  [LED5MM]
LED965  LED5MM  [LED5MM]
LED966  LED5MM  [LED5MM]
LED967  LED5MM  [LED5MM]
LED968  LED5MM  [LED5MM]
LED969  LED5MM  [LED5MM]
LED970  LED5MM  [LED5MM]
LED971  LED5MM  [LED5MM]
LED972  LED5MM  [LED5MM]
LED973  LED5MM  [LED5MM]
LED974  LED5MM  [LED5MM]
LED975  LED5MM  [LED5MM]
LED976  LED5MM  [LED5MM]
LED977  LED5MM  [LED5MM]
LED978  LED5MM  [LED5MM]
LED979  LED5MM  [LED5MM]
LED980  LED5MM  [LED5MM]
LED981  LED5MM  [LED5MM]
LED982  LED5MM  [LED5MM]
LED983  LED5MM  [LED5MM]
LED984  LED5MM  [LED5MM]
LED985  LED5MM  [LED5MM]
LED986  LED5MM  [LED5MM]
LED987  LED5MM  [LED5MM]
LED988  LED5MM  [LED5MM]
LED989  LED5MM  [LED5MM]
LED990  LED5MM  [LED5MM]
LED991  LED5MM  [LED5MM]
LED992  LED5MM  [LED5MM]
LED993  LED5MM  [LED5MM]
LED994  LED5MM  [LED5MM]
LED995  LED5MM  [LED5MM]
LED996  LED5MM  [LED5MM]
LED997  LED5MM  [LED5MM]
LED998  LED5MM  [LED5MM]
LED999  LED5MM  [LED5MM]
LED1000  LED5MM  [LED5MM]
LED1001  LED5MM  [LED5MM]
LED1002  LED5MM  [LED5MM]
LED1003  LED5MM  [LED5MM]
LED1004  LED5MM  [LED5MM]
LED1005  LED5MM  [LED5MM]
LED1006  LED5MM  [LED5MM]
LED1007  LED5MM  [LED5MM]
LED1008  LED5MM  [LED5MM]
LED1009  LED5MM  [LED5MM]
LED1010  LED5MM  [LED5MM]
LED1011  LED5MM  [LED5MM]
LED1012  LED5MM  [LED5MM]
LED1013  LED5MM  [LED5MM]
LED1014  LED5MM  [LED5MM]
LED1015  LED5MM  [LED5MM]
LED1016  LED5MM  [LED5MM]
LED1017  LED5MM  [LED5MM]
LED1018  LED5MM  [LED5MM]
LED1019  LED5MM  [LED5MM]
LED1020  LED5MM  [LED5MM]
LED1021  LED5MM  [LED5MM]
LED1022  LED5MM  [LED5MM]
LED1023  LED5MM  [LED5MM]
LED1024  LED5MM  [LED5MM]
LED1025  LED5MM  [LED5MM]
LED1026  LED5MM  [LED5MM]
LED1027  LED5MM  [LED5MM]
LED1028  LED5MM  [LED5MM]
LED1029  LED5MM  [LED5MM]
LED1030  LED5MM  [LED5MM]
LED1031  LED5MM  [LED5MM]
LED1032  LED5MM  [LED5MM]
LED1033  LED5MM  [LED5MM]
LED1034  LED5MM  [LED5MM]
LED1035  LED5MM  [LED5MM]
LED1036  LED5MM  [LED5MM]
LED1037  LED5MM  [LED5MM]
LED1038  LED5MM  [LED5MM]
LED1039  LED5MM  [LED5MM]
LED1040  LED5MM  [LED5MM]
LED1041  LED5MM  [LED5MM]
LED1042  LED5MM  [LED5MM]
LED1043  LED5MM  [LED5MM]
LED1044  LED5MM  [LED5MM]
LED1045  LED5MM  [LED5MM]
LED1046  LED5MM  [LED5MM]
LED1047  LED5MM  [LED5MM]
LED1048  LED5MM  [LED5MM]
LED1049  LED5MM  [LED5MM]
LED1050  LED5MM  [LED5MM]
LED1051  LED5MM  [LED5MM]
LED1052  LED5MM  [LED5MM]
LED1053  LED5MM  [LED5MM]
LED1054  LED5MM  [LED5MM]
LED1055  LED5MM  [LED5MM]
LED1056  LED5MM  [LED5MM]
LED1057  LED5MM  [LED5MM]
LED1058  LED5MM  [LED5MM]
LED1059  LED5MM  [LED5MM]
LED1060  LED5MM  [LED5MM]
LED1061  LED5MM  [LED5MM]
LED1062  LED5MM  [LED5MM]
LED1063  LED5MM  [LED5MM]
LED1064  LED5MM  [LED5MM]
LED1065  LED5MM  [LED5MM]
LED1066  LED5MM  [LED5MM]
LED1067  LED5MM  [LED5MM]
LED1068  LED5MM  [LED5MM]
LED1069  LED5MM  [LED5MM]
LED1070  LED5MM  [LED5MM]
LED1071  LED5MM  [LED5MM]
LED1072  LED5MM  [LED5MM]
LED1073  LED5MM  [LED5MM]
LED1074  LED5MM  [LED5MM]
LED1075  LED5MM  [LED5MM]
LED1076  LED5MM  [LED5MM]
LED1077  LED5MM  [LED5MM]
LED1078  LED5MM  [LED5MM]
LED1079  LED5MM  [LED5MM]
LED1080  LED5MM  [LED5MM]
LED1081  LED5MM  [LED5MM]
LED1082  LED5MM  [LED5MM]
LED1083  LED5MM  [LED5MM]
LED1084  LED5MM  [LED5MM]
LED1085  LED5MM  [LED5MM]
LED1086  LED5MM  [LED5MM]
LED1087  LED5MM  [LED5MM]
LED1088  LED5MM  [LED5MM]
LED1089  LED5MM  [LED5MM]
LED1090  LED5MM  [LED5MM]
LED1091  LED5MM  [LED5MM]
LED1092  LED5MM  [LED5MM]
LED1093  LED5MM  [LED5MM]
LED1094  LED5MM  [LED5MM]
LED1095  LED5MM  [LED5MM]
LED1096  LED5MM  [LED5MM]
LED1097  LED5MM  [LED5MM]
LED1098  LED5MM  [LED5MM]
LED1099  LED5MM  [LED5MM]
LED1100  LED5MM  [LED5MM]
LED1101  LED5MM  [LED5MM]
LED1102  LED5MM  [LED5MM]
LED1103  LED5MM  [LED5MM]
LED1104  LED5MM  [LED5MM]
LED1105  LED5MM  [LED5MM]
LED1106  LED5MM  [LED5MM]
LED1107  LED5MM  [LED5MM]
LED1108  LED5MM  [LED5MM]
LED1109  LED5MM  [LED5MM]
LED1110  LED5MM  [LED5MM]
LED1111  LED5MM  [LED5MM]
LED1112  LED5MM  [LED5MM]
LED1113  LED5MM  [LED5MM]
LED1114  LED5MM  [LED5MM]
LED1115  LED5MM  [LED5MM]
LED1116  LED5MM  [LED5MM]
LED1117  LED5MM  [LED5MM]
LED1118  LED5MM  [LED5MM]
LED1119  LED5MM  [LED5MM]
LED1120  LED5MM  [LED5MM]
LED1121  LED5MM  [LED5MM]
LED1122  LED5MM  [LED5MM]
LED1123  LED5MM  [LED5MM]
LED1124  LED5MM  [LED5MM]
LED1125  LED5MM  [LED5MM]
LED1126  LED5MM  [LED5MM]
LED1127  LED5MM  [LED5MM]
LED1128  LED5MM  [LED5MM]
LED1129  LED5MM  [LED5MM]
LED1130  LED5MM  [LED5MM]
LED1131  LED5MM  [LED5MM]
LED1132  LED5MM  [LED5MM]
LED1133  LED5MM  [LED5MM]
LED1134  LED5MM  [LED5MM]
LED1135  LED5MM  [LED5MM]
LED1136  LED5MM  [LED5MM]
LED1137  LED5MM  [LED5MM]
LED1138  LED5MM  [LED5MM]
LED1139  LED5MM  [LED5MM]
LED1140  LED5MM  [LED5MM]
LED1141  LED5MM  [LED5MM]
LED1142  LED5MM  [LED5MM]
LED1143  LED5MM  [LED5MM]
LED1144  LED5MM  [LED5MM]
LED1145  LED5MM  [LED5MM]
LED1146  LED5MM  [LED5MM]
LED1147  LED5MM  [LED5MM]
LED1148  LED5MM  [LED5MM]
LED1149  LED5MM  [LED5MM]
LED1150  LED5MM  [LED5MM]
LED1151  LED5MM  [LED5MM]
LED1152  LED5MM  [LED5MM]
LED1153  LED5MM  [LED5MM]
LED1154  LED5MM  [LED5MM]
LED1155  LED5MM  [LED5MM]
LED1156  LED5MM  [LED5MM]
LED1157  LED5MM  [LED5MM]
LED1158  LED5MM  [LED5MM]
LED1159  LED5MM  [LED5MM]
LED1160  LED5MM  [LED5MM]
LED1161  LED5MM  [LED5MM]
LED1162  LED5MM  [LED5MM]
LED1163  LED5MM  [LED5MM]
LED1164  LED5MM  [LED5MM]
LED1165  LED5MM  [LED5MM]
LED1166  LED5MM  [LED5MM]
LED1167  LED5MM  [LED5MM]
LED1168  LED5MM  [LED5MM]
LED1169  LED5MM  [LED5MM]
LED1170  LED5MM  [LED5MM]
LED1171  LED5MM  [LED5MM]
LED1172  LED5MM  [LED5MM]
LED1173  LED5MM  [LED5MM]
LED1174  LED5MM  [LED5MM]
LED1175  LED5MM  [LED5MM]
LED1176  LED5MM  [LED5MM]
LED1177  LED5MM  [LED5MM]
LED1178  LED5MM  [LED5MM]
LED1179  LED5MM  [LED5MM]
LED1180  LED5MM  [LED5MM]
LED1181  LED5MM  [LED5MM]
LED1182  LED5MM  [LED5MM]
LED1183  LED5MM  [LED5MM]
LED1184  LED5MM  [LED5MM]
LED1185  LED5MM  [LED5MM]
LED1186  LED5MM  [LED5MM]
LED1187  LED5MM  [LED5MM]
LED1188  LED5MM  [LED5MM]
LED1189  LED5MM  [LED5MM]
LED1190  LED5MM  [LED5MM]
LED1191  LED5MM  [LED5MM]
LED1192  LED5MM  [LED5MM]
LED1193  LED5MM  [LED5MM]
LED1194  LED5MM  [LED5MM]
LED1195  LED5MM  [LED5MM]
LED1196  LED5MM  [LED5MM]
LED1197  LED5MM  [LED5MM]
LED1198  LED5MM  [LED5MM]
LED1199  LED5MM  [LED5MM]
LED1200  LED5MM  [LED5MM]
LED1201  LED5MM  [LED5MM]
LED1202  LED5MM  [LED5MM]
LED1203  LED5MM  [LED5MM]
LED1204  LED5MM  [LED5MM]
LED1205  LED5MM  [LED5MM]
LED1206  LED5MM  [LED5MM]
LED1207  LED5MM  [LED5MM]
LED1208  LED5MM  [LED5MM]
LED1209  LED5MM  [LED5MM]
LED1210  LED5MM  [LED5MM]
LED1211  LED5MM  [LED5MM]
LED1212  LED5MM  [LED5MM]
LED1213  LED5MM  [LED5MM]
LED1214  LED5MM  [LED5MM]
LED1215  LED5MM  [LED5MM]
LED1216  LED5MM  [LED5MM]
LED1217  LED5MM  [LED5MM]
LED1218  LED5MM  [LED5MM]
LED1219  LED5MM  [LED5MM]
LED1220  LED5MM  [LED5MM]
LED1221  LED5MM  [LED5MM]
LED1222  LED5MM  [LED5MM]
LED1223  LED5MM  [LED5MM]
LED1224  LED5MM  [LED5MM]
LED1225  LED5MM  [LED5MM]
LED1226  LED5MM  [LED5MM]
LED1227  LED5MM  [LED5MM]
LED1228  LED5MM  [LED5MM]
LED1229  LED5MM  [LED5MM]
LED1230  LED5MM  [LED5MM]
LED1231  LED5MM  [LED5MM]
LED1232  LED5MM  [LED5MM]
LED1233  LED5MM  [LED5MM]
LED1234  LED5MM  [LED5MM]
LED1235  LED5MM  [LED5MM]
LED1236  LED5MM  [LED5MM]
LED1237  LED5MM  [LED5MM]
LED1238  LED5MM  [LED5MM]
LED1239  LED5MM  [LED5MM]
LED1240  LED5MM  [LED5MM]
LED1241  LED5MM  [LED5MM]
LED1242  LED5MM  [LED5MM]
LED1243  LED5MM  [LED5MM]
LED1244  LED5MM  [LED5MM]
LED1245  LED5MM  [LED5MM]
LED1246  LED5MM  [LED5MM]
LED1247  LED5MM  [LED5MM]
LED1248  LED5MM  [LED5MM]
LED1249  LED5MM  [LED5MM]
LED1250  LED5MM  [LED5MM]
LED1251  LED5MM  [LED5MM]
LED1252  LED5MM  [LED5MM]
LED1253  LED5MM  [LED5MM]
LED1254  LED5MM  [LED5MM]
LED1255  LED5MM  [LED5MM]
LED1256  LED5MM  [LED5MM]
LED1257  LED5MM  [LED5MM]
LED1258  LED5MM  [LED5MM]
LED1259  LED5MM  [LED5MM]
LED1260  LED5MM  [LED5MM]
LED1261  LED5MM  [LED5MM]
LED1262  LED5MM  [LED5MM]
LED1263  LED5MM  [LED5MM]
LED1264  LED5MM  [LED5MM]
LED1265  LED5MM  [LED5MM]
LED1266  LED5MM  [LED5MM]
LED1267  LED5MM  [LED5MM]
LED1268  LED5MM  [LED5MM]
LED1269  LED5MM  [LED5MM]
LED1270  LED5MM  [LED5MM]
LED1271  LED5MM  [LED5MM]
LED1272  LED5MM  [LED5MM]
LED1273  LED5MM  [LED5MM]
LED1274  LED5MM  [LED5MM]
LED1275  LED5MM  [LED5MM]
LED1276  LED5MM  [LED5MM]
LED1277  LED5MM  [LED5MM]
LED1278  LED5MM  [LED5MM]
LED1279  LED5MM  [LED5MM]
LED1280  LED5MM  [LED5MM]
Q1  XTAL/S  [QS]
R1  100  R-EU_0207/10  [0207/10]
R2  100  R-EU_0207/10  [0207/10]
R3  100  R-EU_0207/10  [0207/10]
R4  100  R-EU_0207/10  [0207/10]
R5  100  R-EU_0207/10  [0207/10]
R6  100  R-EU_0207/10  [0207/10]
R7  100  R-EU_0207/10  [0207/10]
R8  100  R-EU_0207/10  [0207/10]
R9  100  R-EU_0207/10  [0207/10]
R10  100  R-EU_0207/10  [0207/10]
R11  100  R-EU_0207/10  [0207/10]
R12  100  R-EU_0207/10  [0207/10]
R13  100  R-EU_0207/10  [0207/10]
R14  100  R-EU_0207/10  [0207/10]
R15  100  R-EU_0207/10  [0207/10]
R16  100  R-EU_0207/10  [0207/10]
R17  10k  R-EU_0207/10  [0207/10]
S1  10-XX  [B3F-10XX]
SL1  M02  [02P]
X1  PN87520  [PN87520]